# EasyEDA schematic Bike sharing system final one with 30 pin esp32.json
TITLE: Sheet_1; REV: 1.0; Date: 2026-04-06; Sheet: 1/1; Company: Your Company
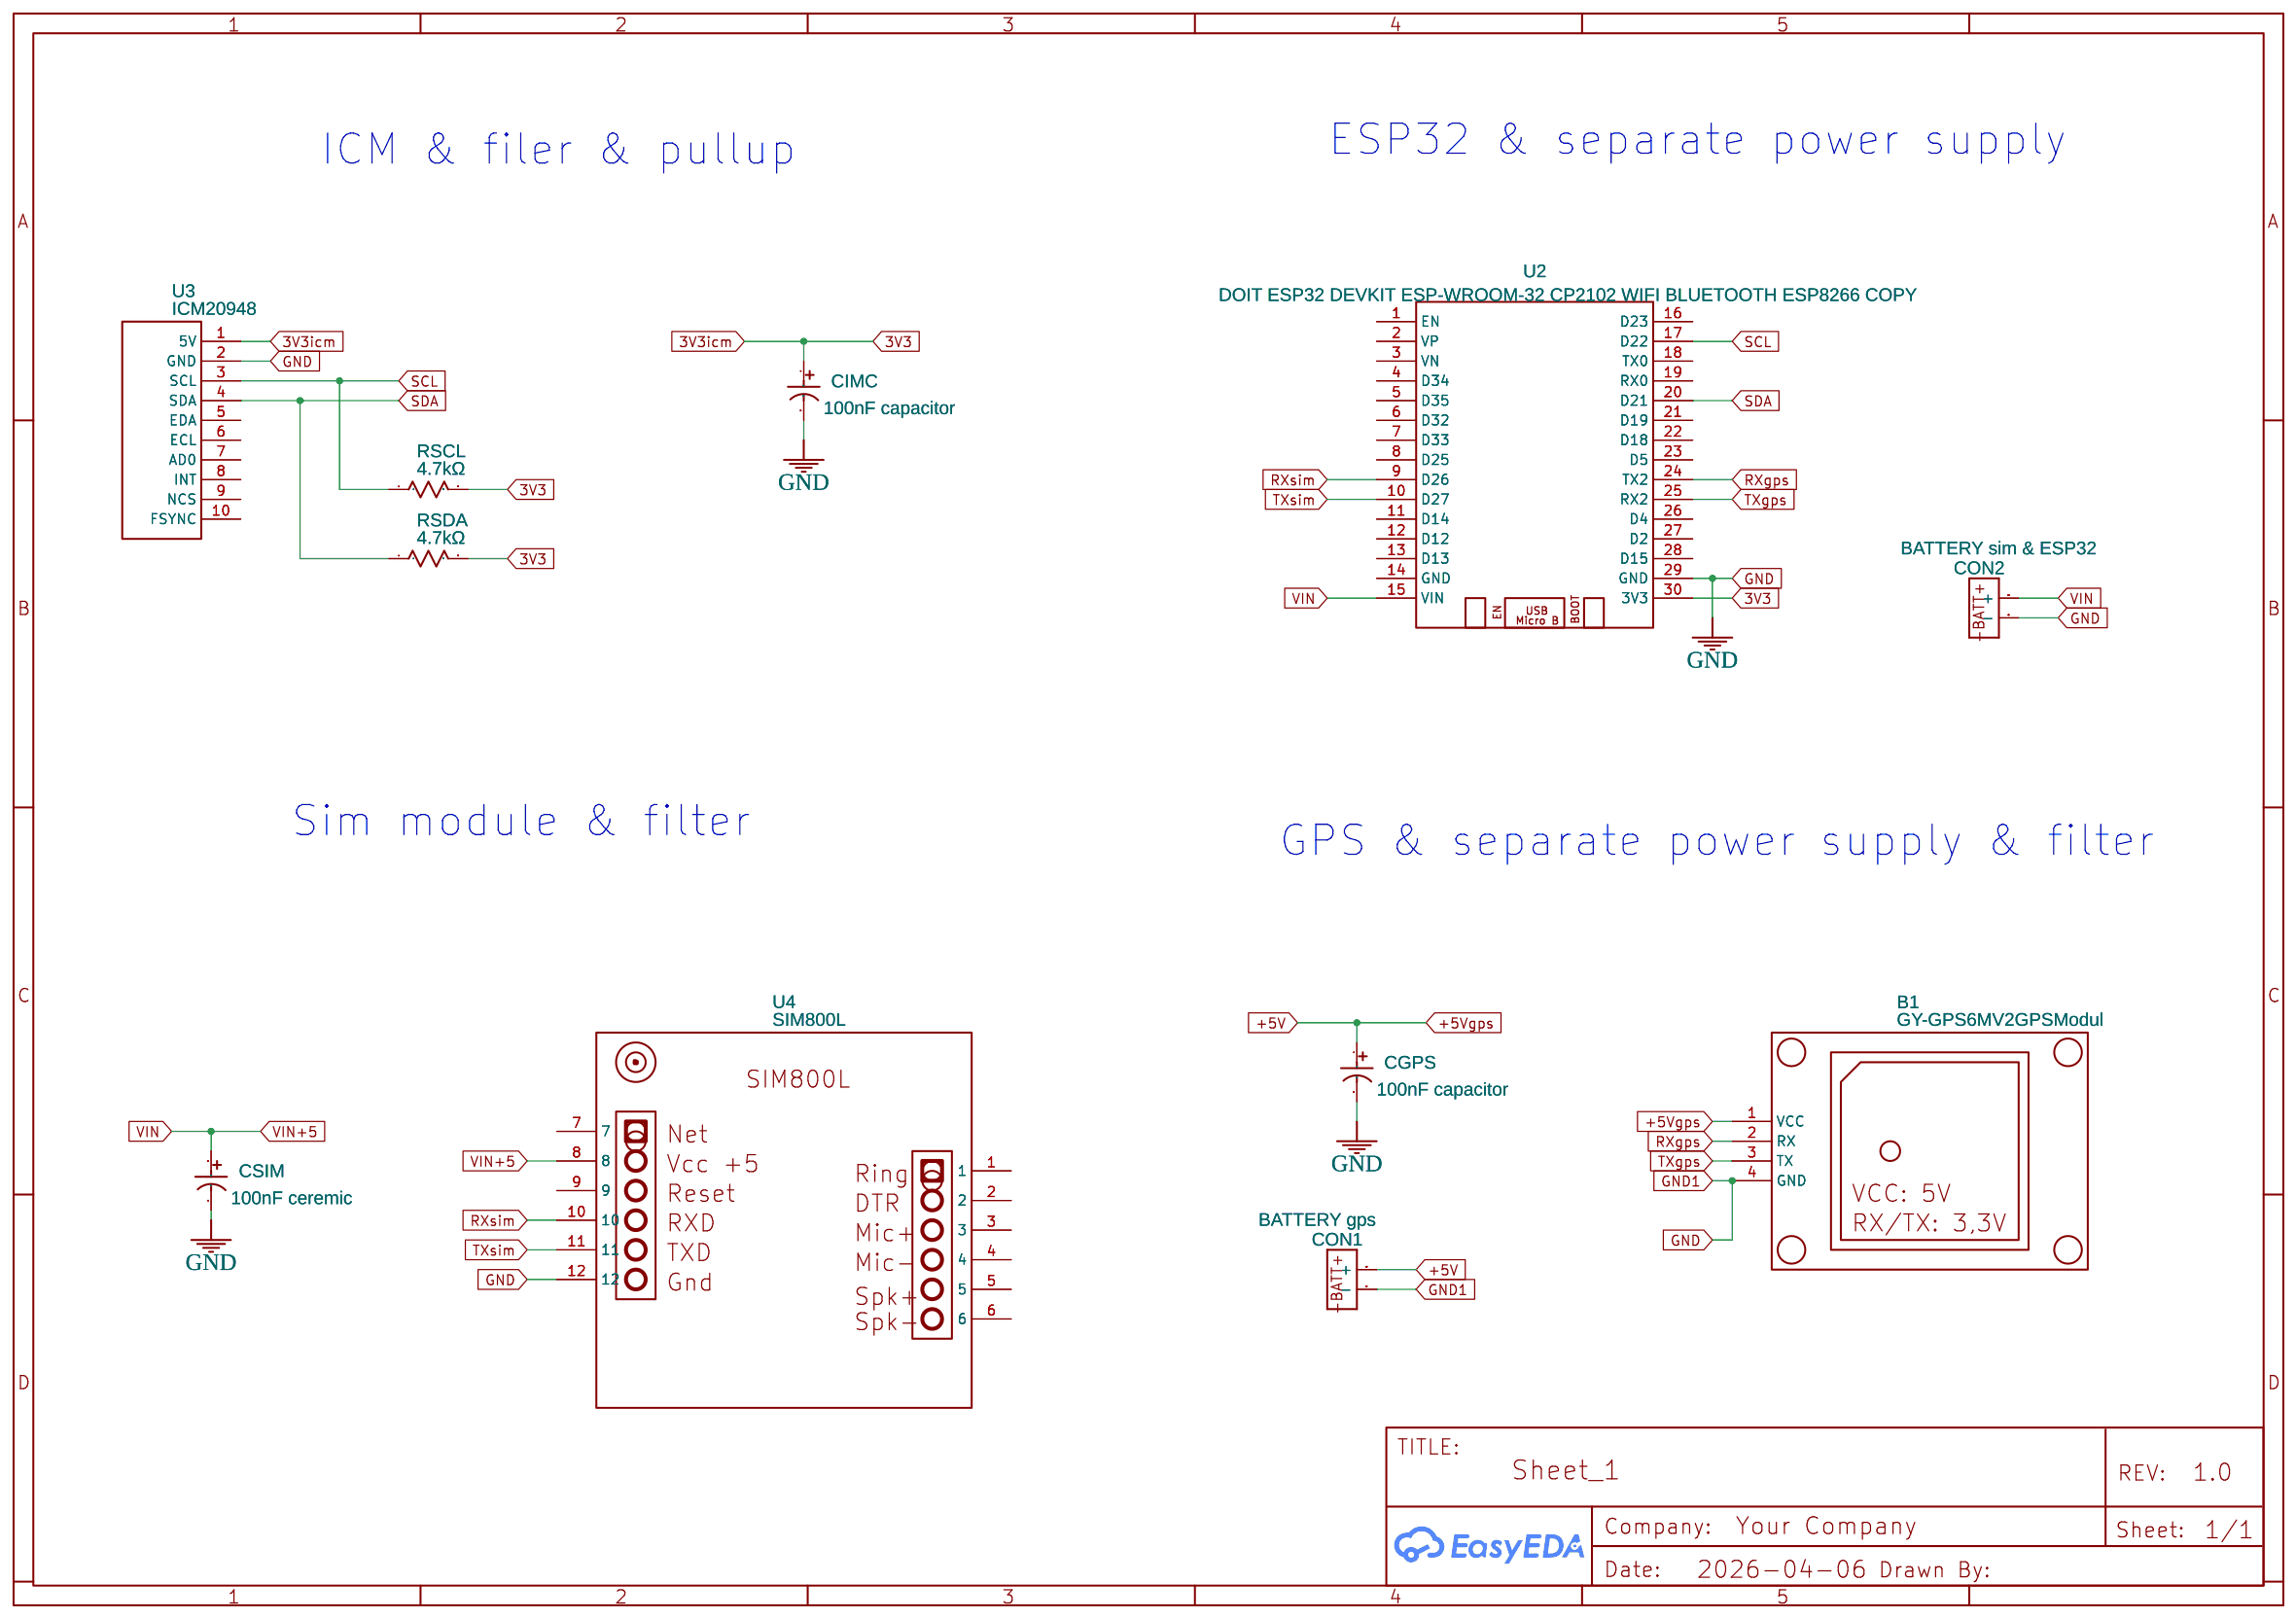
[diagram p0: schematic sheet]

## Parts
B1  GY-GPS6MV2GPSModul  [GY-GPS6MV2GPSMODUL]
CGPS  100nF capacitor  [CAPACITOR, 100UF 2.54MM PIN CAPACITOR]
CIMC  100nF capacitor  [CAPACITOR, 100UF 2.54MM PIN CAPACITOR]
CON1  BATTERY gps  [2PIN-CON-BATT [PCB]]
CON2  BATTERY sim & ESP32  [2PIN-CON-BATT [PCB]]
CSIM  100nF ceremic  [CAPACITOR, 100UF 2.54MM PIN CAPACITOR]
RSCL  4.7kΩ  [RESISTER]
RSDA  4.7kΩ  [RESISTER]
U2  DOIT ESP32 DEVKIT ESP-WROOM-32 CP2102 WIFI BLUETOOTH ESP8266 COPY  [DOIT-ESP32-DEVKIT-V1]
U3  ICM20948  [ICM20948]
U4  SIM800L  [SIM800L]

## Library data of the parts
B1 = GY-GPS6MV2GPSModul: Contributor: Nikesh52kar
CGPS CIMC CSIM = CAPACITOR 680UF COPY: Supplier: LCSC; Manufacturer: CX(承兴); Manufacturer Part: KM476M016D11RR0VH2FP0; Supplier Part: C22320; JLCPCB Part Class: Extended Part; Contributor: sugarlight0301
CON1 CON2 = 2 PIN CON (BATTERY): Contributor: SparkFun; sourceId: XhtFfq0Ay
RSCL RSDA = RESISTER COPY: Manufacturer Part: Resister; Contributor: kaungmyatkyaw
U2 = DOIT ESP32 DEVKIT ESP-WROOM-32 CP2102 WIFI BLUETOOTH ESP8266 COPY: Contributor: K1ck09; Supplier: Ali Express; link: https://pt.aliexpress.com/item/32842731763.html
U3 = ICM20948: Contributor: afgasgasdg
U4 = SIM800L: Contributor: jubaid_hasan

## Nets
3V3: CIMC.1 RSCL.2 RSDA.2 U2.30(3V3) U3.1(5V)
+5V: B1.1(VCC) CGPS.1 CON1.BAT+(+)
GND: B1.4(GND) CGPS.2 CIMC.2 CON1.BAT-(-) CON2.BAT-(-) CSIM.2 U2.29(GND) U3.2(GND) U4.12
VIN: CON2.BAT+(+) CSIM.1 U2.15(VIN) U4.8
RXgps: B1.2(RX) U2.24(TX2)
RXsim: U2.9(D26) U4.10
SCL: RSCL.1 U2.17(D22) U3.3(SCL)
SDA: RSDA.1 U2.20(D21) U3.4(SDA)
TXgps: B1.3(TX) U2.25(RX2)
TXsim: U2.10(D27) U4.11

Not connected (* = marked no-connect by the designer): U2 1(EN) 2(VP) 3(VN) 4(D34) 5(D35) 6(D32) 7(D33) 8(D25) 11(D14) 12(D12) 13(D13) 14(GND) 16(D23) 18(TX0) 19(RX0) 21(D19) 22(D18) 23(D5) 26(D4) 27(D2) 28(D15); U3 5(EDA) 6(ECL) 7(AD0) 8(INT) 9(NCS) 10(FSYNC); U4 1 2 3 4 5 6 7 9

## Notes on the sheet
- ICM & filer & pullup
- ESP32 & separate power supply
- Sim module & filter
- GPS & separate power supply & filter
